# EAGLE design Grove - 3-Axis Analog Accelerometer v1.1 (EAGLE 6.3)
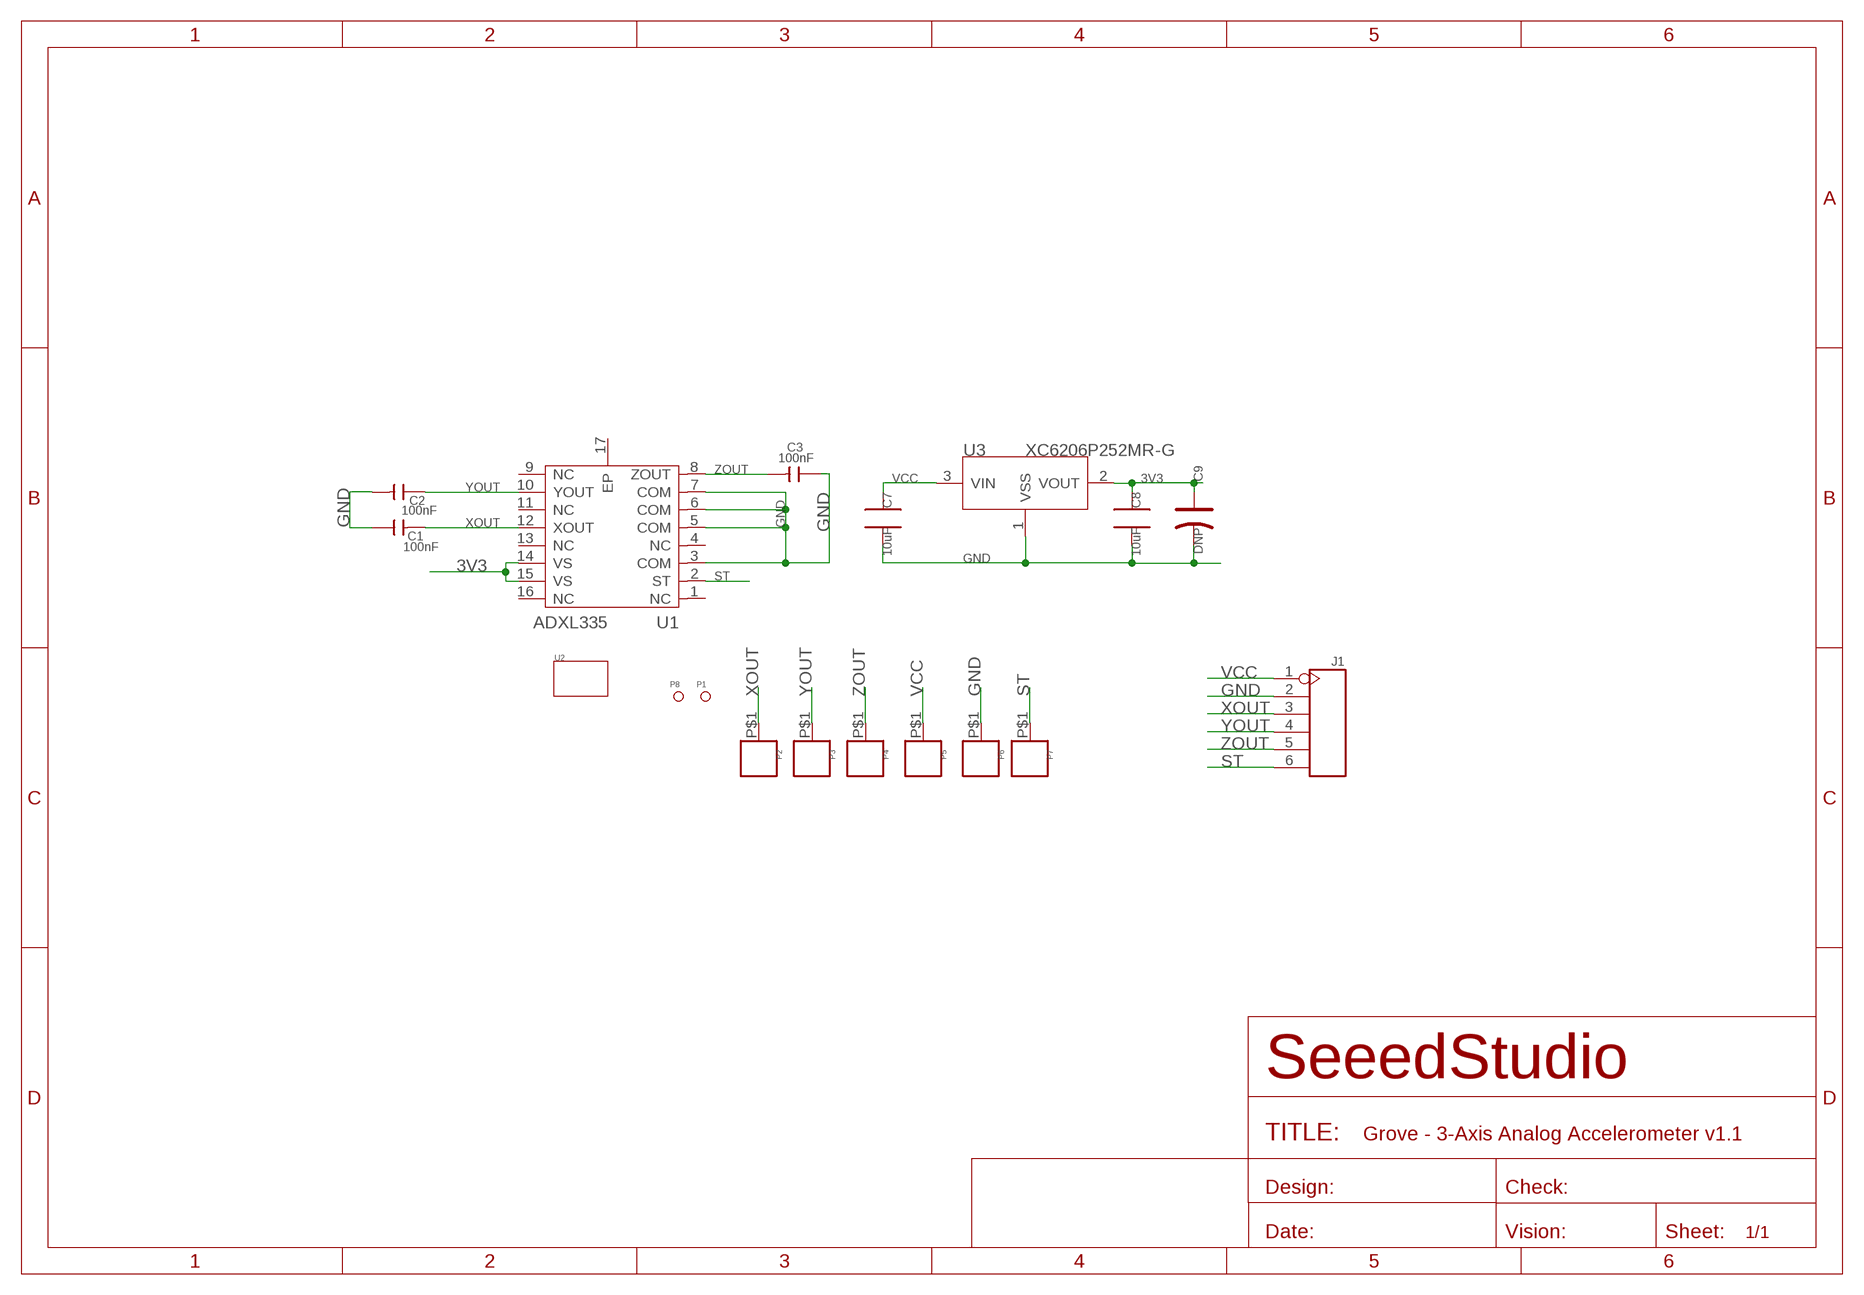
[diagram p0: schematic, sheet 1]

## Parts
C1  100nF  C-0603  [C0603]
C2  100nF  C-0603  [C0603]
C3  100nF  C-0603  [C0603]
C7  10uF  C0805_S  [0805_S]
C8  10uF  C0805_S  [0805_S]
C9  DNP  CAP-AVX-A  [AVX-A]
J1  HEADER-6P-60/35MIL  [6P-2.54-60/35MIL]
P1  PAD-MARK  [ROUND-MARK-1.0]
P2  PAD'1X2MM'  [1P-1X2]
P3  PAD'1X2MM'  [1P-1X2]
P4  PAD'1X2MM'  [1P-1X2]
P5  PAD'1X2MM'  [1P-1X2]
P6  PAD'1X2MM'  [1P-1X2]
P7  PAD'1X2MM'  [1P-1X2]
P8  PAD-MARK  [ROUND-MARK-1.0]
U1  ADXL335  [LFCSP16-4X4]
U2  TWIG-1U  [1U-DIM-W/-DRILL]
U3  XC6206P252MR-G  XC6206MR  [SOT23]

## Nets
3V3: C8.1 C9.+ U1.14(VS) U1.15(VS) U3.2(VOUT)
GND: C1.1 C2.2 C3.1 C7.2 C8.2 C9.- J1.2 P6.P$1 U1.3(COM) U1.5(COM) U1.6(COM) U1.7(COM) U3.1(VSS)
ST: J1.6 P7.P$1 U1.2(ST)
VCC: C7.1 J1.1 P5.P$1 U3.3(VIN)
XOUT: C1.2 J1.3 P2.P$1 U1.12(XOUT)
YOUT: C2.1 J1.4 P3.P$1 U1.10(YOUT)
ZOUT: C3.2 J1.5 P4.P$1 U1.8(ZOUT)
Unconnected: U1.1(NC) U1.4(NC) U1.9(NC) U1.11(NC) U1.13(NC) U1.16(NC) U1.17(EP)

## Library data of the parts
C1-C3 = Discrete:C*: Ceramic Capacitors
C7 C8 = CPT_SMD:C0805
C9 = Discrete:CAP*: Electrolytic Capacitors,Tantalum Capacitors and Super Capacitors
J1 = Connector:HEADER-6P
P1 P8 = Discrete:PAD-MARK; PARTNO: DNP
P2-P7 = Discrete:PAD
U1 = IC:ADXL335: Small,Low Power,3-Axis+/-3g Accelerometer
U2 = Module:TWIG
U3 = IC:XC6206: LOW ESR Cap.Compatible Positive Voltage Regulators

## Net classes
0 default: width 0.152 mm, drill 0.152 mm, clearance 0.152 mm

## Board
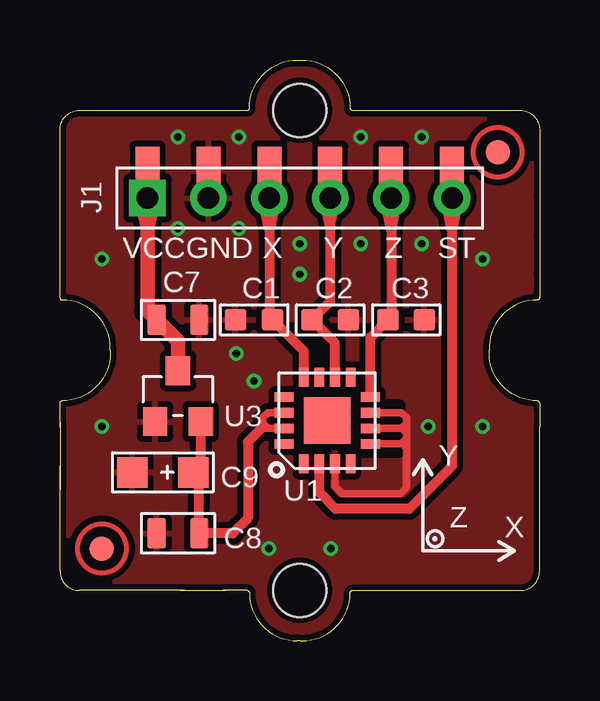
[diagram p1: board, top side]
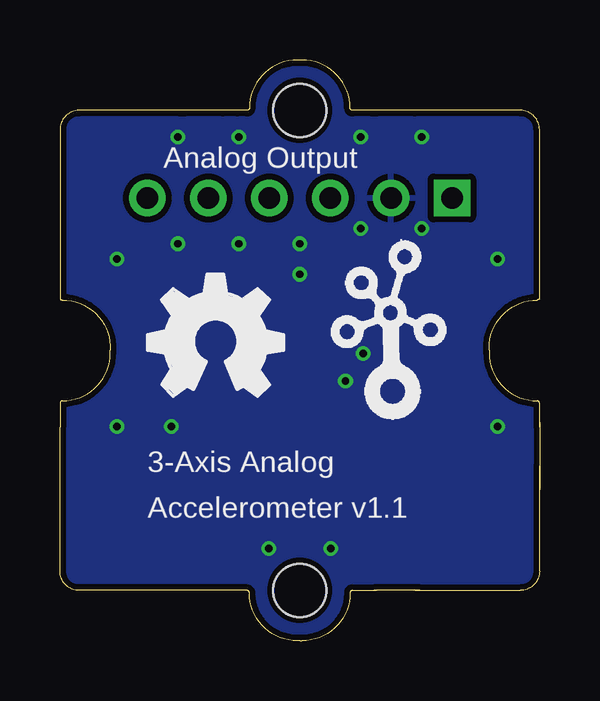
[diagram p2: board, bottom side, seen from below]

Size 20 x 24.2 mm. Coordinates in mm from the lower left corner, seen from the top.
Copper layers (1*16): Top 0.035mm / dielectric 1.5mm / Bottom 0.035mm
Design rules "SeeedStudio_rule_no_angle_090911 *": minimum track width 6mil, minimum drill 12mil, track to track 6mil, track to pad 6mil, pad to pad 6mil, via to via 6mil, smd to smd 0mil, copper to edge 10mil, drill to drill 10mil, minimum pad ring 10mil, minimum via ring 6mil, stop-mask expansion 2mil, vias tented up to drill 25mil, thermal gap 10mil
tRestrict: area 12.5,7.9 to 14.2,9.8

### Footprints (pad centres in the part's own frame; a part is rotated, then mirrored left to right if it is on the bottom)
C0603 = smd 0.889 x 0.889: 1 -0.762,0; 2 0.762,0
0805_S = smd 0.762 x 1.27: 1 -0.889,0; 2 0.889,0
AVX-A = smd 1.27 x 1.27: + -1.27,0; - 1.27,0
6P-2.54-60/35MIL = drill 0.889 pad 1.524 square: 1 0,6.35 | drill 0.889 pad 1.524: 2 0,3.81; 3 0,1.27; 4 0,-1.27; 5 0,-3.81; 6 0,-6.35
ROUND-MARK-1.0 = smd 1.016 x 1.016: P$1 0,0
1P-1X2 = smd 2 x 1: P$1 0,0
LFCSP16-4X4 = smd 0.8 x 0.4: 1 -1.8,0.975; 2 -1.8,0.325; 3 -1.8,-0.325; 4 -1.8,-0.975; 9 1.8,-0.975; 10 1.8,-0.325; 11 1.8,0.325; 12 1.8,0.975 | smd 0.4 x 0.8: 5 -0.975,-1.8; 6 -0.325,-1.8; 7 0.325,-1.8; 8 0.975,-1.8; 13 0.975,1.8; 14 0.325,1.8; 15 -0.325,1.8; 16 -0.975,1.8 | smd 1.95 x 1.95: 17 0,0
1U-DIM-W/-DRILL = hole 2.2: 0,-10; 0,10
SOT23 = smd 1.016 x 1.2: 1 -0.95,-1.06; 2 0.95,-1.06; 3 0,1.06

### Placement (x,y rotation side)
C1  8.1,13.37 0 top
C2  11.27,13.37 0 top
C3  14.45,13.37 180 top
C7  4.92,13.37 0 top
C8  4.92,4.48 180 top
C9  4.29,7.02 180 top
J1  10,18.45 90 top
P1  18.26,20.36 0 top
P2  8.73,19.59 90 top
P3  11.27,19.59 90 top
P4  13.81,19.59 90 top
P5  3.65,19.59 90 top
P6  6.19,19.59 90 top
P7  16.35,19.59 90 top
P8  1.74,3.84 0 top
U1  11.14,9.18 90 top
U2  10,12.1 0 top
U3  4.92,10.2 0 top
U$1  [OSHW_FILLX200_NOTEXT]  16.35,10.2 0 bottom
U$2  [TWIGLOGO]  6.19,10.2 0 bottom

### Tracks (layer width: path | path; a pad name or v marks a point on that pad's centre or on a via)
3V3
  Top 0.305: U1.14 8.67,9.5 8.48,9.31 8.48,9.05 | 8.48,9.05 8.48,8.93 8.48,8.85 8.67,8.85 | U1.15 8.67,8.85 | 8.67,8.85 8.48,9.05
  Top 0.406: 6.15,8.85 U3.2 5.87,7.02 | 5.87,7.02 5.87,6.83 5.81,6.77 5.94,6.77 C9.+ | 5.87,7.02 5.81,6.96 C8.1 7.21,4.48 7.84,5.11 7.84,8.29 8.48,8.93
GND  (via drill 0.3)
  Top 0.305: 12.94,8.21 U1.5 14.23,8.2 | U1.7 14.25,9.5 14.45,9.31 14.45,9.05 | U1.6 14.25,8.85 | 14.26,8.85 14.37,8.85 14.45,8.93 | 14.23,8.2 14.36,8.2 14.45,8.29 | U1.3 11.47,6.44 11.78,6.13 14.19,6.13 14.45,6.38 14.45,8.04 | 14.45,8.04 14.45,8.29 | 14.45,8.29 14.45,8.42 | 14.45,8.42 14.45,8.67 | 14.45,8.67 14.45,8.93 | 14.45,8.93 14.45,9.05 | 14.25,8.85 14.45,9.05 | 14.25,8.85 14.26,8.85 | 14.26,8.85 14.45,8.67 | 14.23,8.2 14.45,8.42 | 14.45,8.04 14.32,8.16
  other vias: 1.74,15.91 1.74,8.93 8.1,10.83 17.62,15.91 17.62,8.93 11.3,3.84 8.7,3.84 7.46,20.99 10,15.27 12.54,20.99 15.08,20.99 4.92,20.99 7.36,11.97 15.36,8.93 4.92,17.18 7.46,17.18 10,16.55 12.54,16.55 15.08,16.55
  pour Bottom (isolate 0.254): -3.21,25.56 -3.21,-1.87 22.7,-1.87 22.7,25.56
  pour Top (isolate 0.254): -3.21,25.56 -3.21,-1.87 22.7,-1.87 22.7,25.56
ST
  Top 0.406: J1.6 16.35,17.12 | U1.2 10.81,6.18 11.5,5.5 14.57,5.5 16.35,7.27 16.35,17.12 | 16.35,17.12 | 16.08,18.39 | 16.35,17.12 16.62,18.39 | 16.35,17.12 16.08,18.39 | 16.08,18.39 | J1.6 16.08,18.39 | 16.62,18.39 16.35,17.12 | 16.62,18.39 | 16.08,18.39 16.35,17.12 | 16.08,18.39 J1.6 | 16.62,18.39 16.35,17.12 | 16.35,17.12 | 16.08,18.39 16.35,17.12 | 16.62,18.39 16.35,17.12 | J1.6 16.62,18.39 | 16.08,18.39 16.35,17.12 | J1.6 16.08,18.39 | 16.62,18.39 16.35,17.12 | J1.6 16.62,18.39 | 16.08,18.39 16.35,17.12 | J1.6 16.08,18.39 | P7.P$1 J1.6
VCC
  Top 0.61: P5.P$1 J1.1 3.65,17.31 | 3.65,17.31 3.4,18.32 3.9,18.32 3.65,17.31 | U3.3 4.92,12.48 4.16,13.24 C7.1 3.65,13.75 3.65,17.31
XOUT
  Top 0.406: 8.73,17.12 J1.3 | 9,18.39 | 8.73,17.12 | 8.73,17.12 9,18.39 | 9,18.39 | J1.3 9,18.39 | 8.73,17.12 8.46,18.39 | 8.46,18.39 | 8.73,17.12 9,18.39 | 8.73,17.12 8.46,18.39 | 9,18.39 8.73,17.12 | 9,18.39 J1.3 | 8.73,17.12 | 8.46,18.39 8.73,17.12 | 8.46,18.39 J1.3 | 8.73,17.12 9,18.39 | J1.3 9,18.39 | 8.46,18.39 8.73,17.12 | 8.46,18.39 J1.3 | J1.3 P2.P$1 | 8.73,17.12 8.73,13.5 C1.2 10.17,12.06 U1.12
YOUT
  Top 0.406: 11.27,17.31 J1.4 11.27,18.7 | 11.27,17.31 11.27,14.13 C2.1 11.47,12.41 U1.10 | 11.27,18.83 P3.P$1 | 11.27,17.31 11.52,18.39 11.27,18.7 | 11.27,17.31 11.02,18.39 11.4,18.7 11.27,18.83 | 11.27,18.83 11.27,18.7
ZOUT
  Top 0.406: 13.81,17.12 J1.5 | 13.81,17.12 14.08,18.39 J1.5 | 13.81,17.12 13.54,18.39 J1.5 | J1.5 P4.P$1 | U1.8 12.94,12.63 C3.2 13.81,13.5 13.81,17.12

### Text on the board
tNames: VCC | GND | X | Y | Z | ST | Y | Z | X
bNames: Analog Output | 3-Axis Analog | Accelerometer v1.1